# Altium schematic sheet Anode.SchDoc
size A4; DocumentNumber: 1; SheetNumber: 2
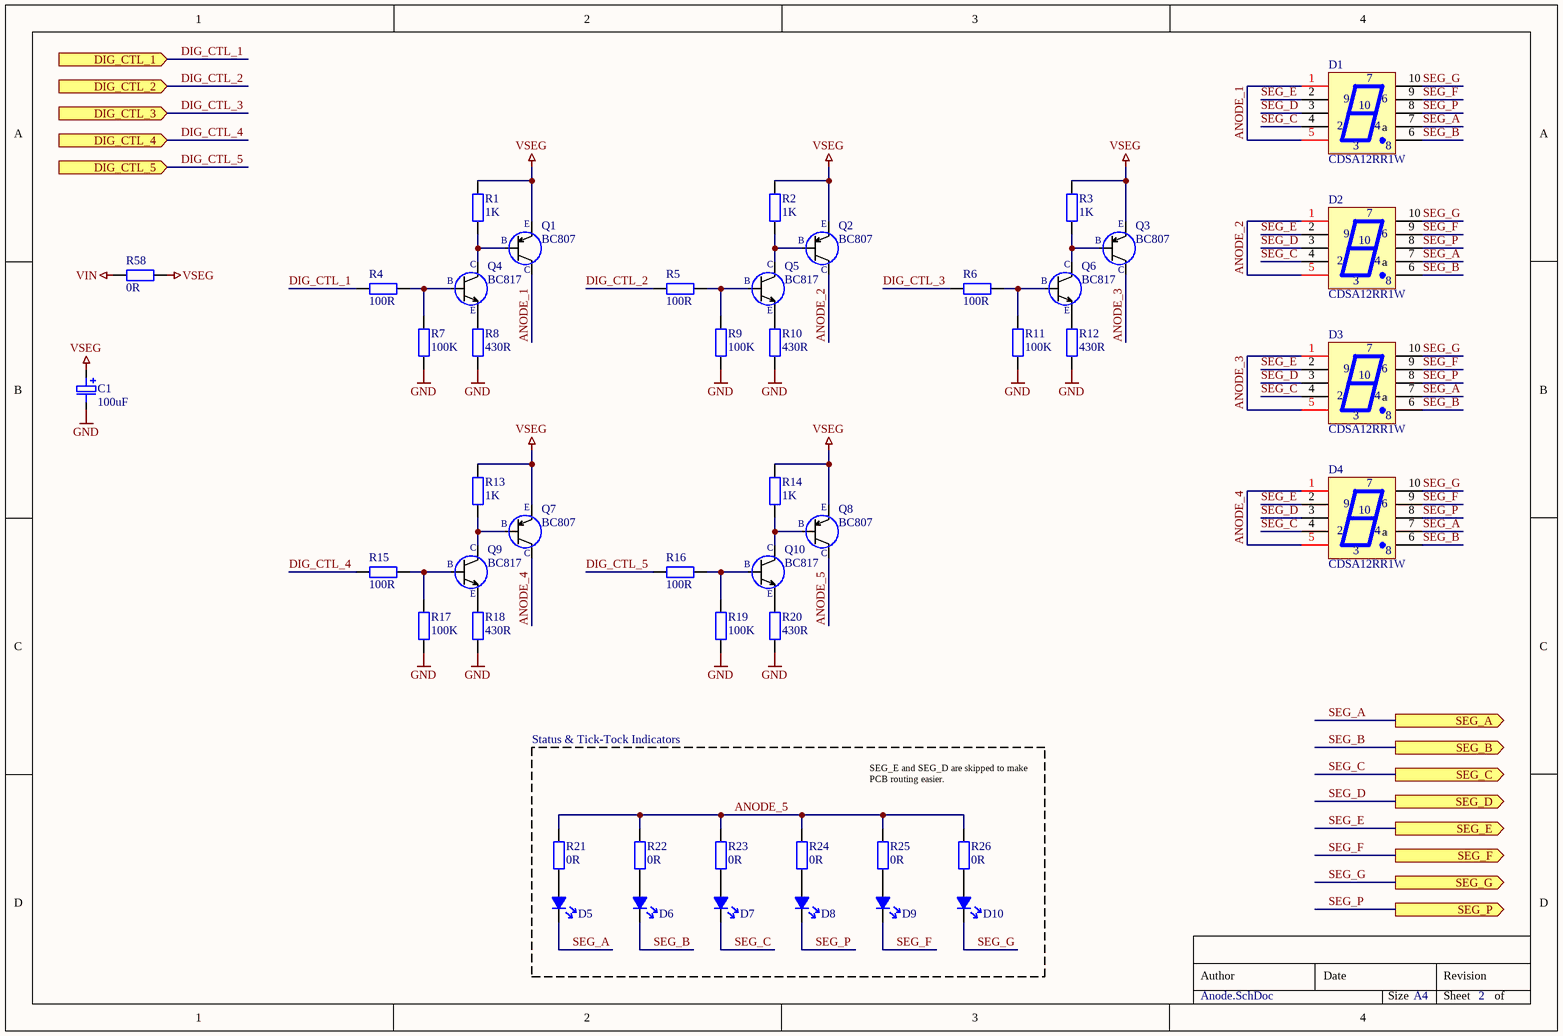
[diagram p0: Anode.SchDoc]

## Parts
C1  100uF  [C_EL_B_4MM_RF_M]
D1  CDSA12RR1W  [CDSX12]
D2  CDSA12RR1W  [CDSX12]
D3  CDSA12RR1W  [CDSX12]
D4  CDSA12RR1W  [CDSX12]
D5  Unspecified  [1206LED_RF_M]  (value not drawn)
D6  Unspecified  [1206LED_RF_M]  (value not drawn)
D7  Unspecified  [1206LED_RF_M]  (value not drawn)
D8  Unspecified  [1206LED_RF_M]  (value not drawn)
D9  Unspecified  [1206LED_RF_M]  (value not drawn)
D10  Unspecified  [1206LED_RF_M]  (value not drawn)
Q1  BC807  [IRLML_SOT-23]
Q2  BC807  [IRLML_SOT-23]
Q3  BC807  [IRLML_SOT-23]
Q4  BC817  [IRLML_SOT-23]
Q5  BC817  [IRLML_SOT-23]
Q6  BC817  [IRLML_SOT-23]
Q7  BC807  [IRLML_SOT-23]
Q8  BC807  [IRLML_SOT-23]
Q9  BC817  [IRLML_SOT-23]
Q10  BC817  [IRLML_SOT-23]
R1  1K  [0805R_RF_M]
R2  1K  [0805R_RF_M]
R3  1K  [0805R_RF_M]
R4  100R  [0805R_RF_M]
R5  100R  [0805R_RF_M]
R6  100R  [0805R_RF_M]
R7  100K  [0805R_RF_M]
R8  430R  [0805R_RF_M]
R9  100K  [0805R_RF_M]
R10  430R  [0805R_RF_M]
R11  100K  [0805R_RF_M]
R12  430R  [0805R_RF_M]
R13  1K  [0805R_RF_M]
R14  1K  [0805R_RF_M]
R15  100R  [0805R_RF_M]
R16  100R  [0805R_RF_M]
R17  100K  [0805R_RF_M]
R18  430R  [0805R_RF_M]
R19  100K  [0805R_RF_M]
R20  430R  [0805R_RF_M]
R21  0R  [0805R_RF_M]
R22  0R  [0805R_RF_M]
R23  0R  [0805R_RF_M]
R24  0R  [0805R_RF_M]
R25  0R  [0805R_RF_M]
R26  0R  [0805R_RF_M]
R58  0R  [1206R_RF_M]

## Blocks framed on the sheet
Status & Tick-Tock Indicators: D5-D10 R21-R26

## Ports
DIG_CTL_1 (in), DIG_CTL_2 (in), DIG_CTL_3 (in), DIG_CTL_4 (in), DIG_CTL_5 (in), SEG_A (out), SEG_B (out), SEG_C (out), SEG_D (out), SEG_E (out), SEG_F (out), SEG_G (out), SEG_P (out)

## Nets
GND: C1.N R7.1 R8.1 R9.1 R10.1 R11.1 R12.1 R17.1 R18.1 R19.1 R20.1
VIN: R58.1
VSEG: C1.P Q1.2(Emmiter) Q2.2(Emmiter) Q3.2(Emmiter) Q7.2(Emmiter) Q8.2(Emmiter) R1.2 R2.2 R3.2 R13.2 R14.2 R58.2
ANODE_1: D1.1(A) D1.5(A) Q1.3(Collector)
ANODE_2: D2.1(A) D2.5(A) Q2.3(Collector)
ANODE_3: D3.1(A) D3.5(A) Q3.3(Collector)
ANODE_4: D4.1(A) D4.5(A) Q7.3(Collector)
ANODE_5: Q8.3(Collector) R21.2 R22.2 R23.2 R24.2 R25.2 R26.2
DIG_CTL_1: R4.1 ; port DIG_CTL_1
DIG_CTL_2: R5.1 ; port DIG_CTL_2
DIG_CTL_3: R6.1 ; port DIG_CTL_3
DIG_CTL_4: R15.1 ; port DIG_CTL_4
DIG_CTL_5: R16.1 ; port DIG_CTL_5
SEG_A: D1.7(a) D2.7(a) D3.7(a) D4.7(a) D5.C ; port SEG_A
SEG_B: D1.6(b) D2.6(b) D3.6(b) D4.6(b) D6.C ; port SEG_B
SEG_C: D1.4(c) D2.4(c) D3.4(c) D4.4(c) D7.C ; port SEG_C
SEG_D: D1.3(d) D2.3(d) D3.3(d) D4.3(d) ; port SEG_D
SEG_E: D1.2(e) D2.2(e) D3.2(e) D4.2(e) ; port SEG_E
SEG_F: D1.9(f) D2.9(f) D3.9(f) D4.9(f) D9.C ; port SEG_F
SEG_G: D1.10(g) D2.10(g) D3.10(g) D4.10(g) D10.C ; port SEG_G
SEG_P: D1.8(dp) D2.8(dp) D3.8(dp) D4.8(dp) D8.C ; port SEG_P
NetD5_A: D5.A R21.1
NetD6_A: D6.A R22.1
NetD7_A: D7.A R23.1
NetD8_A: D8.A R24.1
NetD9_A: D9.A R25.1
NetD10_A: D10.A R26.1
NetQ1_1: Q1.1(Base) Q4.3(Collector) R1.1
NetQ2_1: Q2.1(Base) Q5.3(Collector) R2.1
NetQ3_1: Q3.1(Base) Q6.3(Collector) R3.1
NetQ4_1: Q4.1(Base) R4.2 R7.2
NetQ4_2: Q4.2(Emmiter) R8.2
NetQ5_1: Q5.1(Base) R5.2 R9.2
NetQ5_2: Q5.2(Emmiter) R10.2
NetQ6_1: Q6.1(Base) R6.2 R11.2
NetQ6_2: Q6.2(Emmiter) R12.2
NetQ7_1: Q7.1(Base) Q9.3(Collector) R13.1
NetQ8_1: Q8.1(Base) Q10.3(Collector) R14.1
NetQ9_1: Q9.1(Base) R15.2 R17.2
NetQ9_2: Q9.2(Emmiter) R18.2
NetQ10_1: Q10.1(Base) R16.2 R19.2
NetQ10_2: Q10.2(Emmiter) R20.2

## Notes on the sheet
- SEG_E and SEG_D are skipped to make PCB routing easier.
- Author
- Date
- Revision
- Size
- A4
- Sheet
- of
- (in symbol BC807-215) E; B; C
- (in symbol BC817-40-215) C; B; E

## Library data of the parts
C1 = C-P: Polarized Capacitor; Manufacturer: Generic Brand; Max Voltage: ? V; Value: 100uF; Mounting Technology: SMT; Tolerance: ?; Tag: *; Manufacturer Part No: *; Supplier: *; Supplier Link: http://; Supplier Part No: *; Category: Capacitor
D1-D4 = CDSA12RR1W: DISPLAY 7SEG 1.20" SGL RED 10DIP; Supplier: DigiKey; Supplier Link: https://www.digikey.com/en/products/detail/chromeled/CDSA12RR1W/13166753; Supplier Part No: 2661-CDSA12RR1W-ND; Mounting Technology: SMT; Package: DIP-10
D5-D10 = LED: Manufacturer: Generic Brand; Forward Voltage Drop: ? V; Emitting Color: Unspecified; Manufacturer Part No: *; Supplier: *; Supplier Link: http://; Supplier Part No: *; Category: Diode; Mounting Technology: SMT
Q1-Q3 Q7 Q8 = BC807-215: TRANS PNP 45V 500MA TO236AB; DC Current Gain: 100; Power Dissipation: 250mW; Supplier Link: https://www.digikey.com/en/products/detail/nexperia-usa-inc/BC807-215/1232227; Alternative Supplier Link: https://www.chipdip.by/product/bc807.215; Supplier: DigiKey; Alternative Supplier: Chipdip; Alternative Supplier Part No: 9000113306; Supplier Part No: 1727-4840-1-ND; Package: SOT-23; Mounting Technology: SMT; Datasheet Link: https://assets.nexperia.com/documents/data-sheet/BC807_BC807W_BC327.pdf; Collector Current: 500mA; Collector-Emitter Breakdown Voltage: 45V
Q4-Q6 Q9 Q10 = BC817-40-215: TRANS NPN 45V 0.5A SOT23; Manufacturer: Nexperia USA Inc.; Manufacturer Part No: BC817-40,215; Collector Current: 500 mA; Collector-Emitter Breakdown Voltage: 45V (max.); Power Dissipation: 250 mW; DC Current Gain: 250 @ 100mA, 1V; Supplier: DigiKey; Supplier Link: https://www.digikey.com/en/products/detail/nexperia-usa-inc/BC817-40-215/763235; Supplier Part No: 1727-2919-1-ND; Mounting Technology: SMT; Category: Transistor/BJT; Alternative Supplier: Chipdip; Alternative Supplier Link: https://www.chipdip.by/product/bc817-40; Alternative Supplier Part No: 28806907; Datasheet Link: https://assets.nexperia.com/documents/data-sheet/BC817_SER.pdf; Package: SOT-23
R1-R26 R58 = R: Resistor; Manufacturer: Generic Brand; Power Rating: ? W; Max Voltage: ? V; Tolerance: ?; Supplier Link: http://; Category: Resistor; Mounting Technology: SMT
  R1-R3 R13 R14: Value: 1K
  R4-R6 R15 R16: Value: 100R
  R7 R9 R11 R17 R19: Value: 100K
  R8 R10 R12 R18 R20: Value: 430R
  R21-R26 R58: Value: 0R